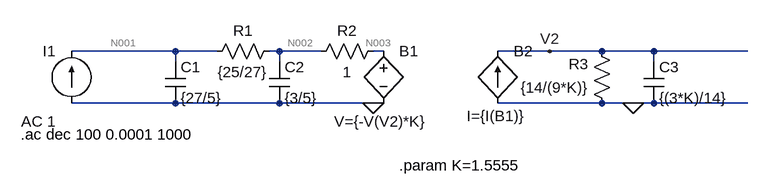
[diagram p0: schematic Draft2.asc]
Draft2.asc, the LTspice schematic file:
Version 4
SHEET 1 932 680
WIRE 48 112 -112 112
WIRE 112 112 48 112
WIRE 208 112 192 112
WIRE 272 112 208 112
WIRE 368 112 352 112
WIRE 624 112 544 112
WIRE 704 112 624 112
WIRE 784 112 704 112
WIRE 928 112 784 112
WIRE 48 128 48 112
WIRE 208 128 208 112
WIRE 784 128 784 112
WIRE 48 192 -112 192
WIRE 208 192 48 192
WIRE 352 192 208 192
WIRE 368 192 352 192
WIRE 704 192 544 192
WIRE 752 192 704 192
WIRE 784 192 752 192
WIRE 928 192 784 192
FLAG 624 112 V2
FLAG 352 192 0
FLAG 752 192 0
SYMBOL cap 32 128 R0
SYMATTR InstName C1
SYMATTR Value {27/5}
SYMBOL res 208 96 R90
WINDOW 0 0 56 VBottom 2
WINDOW 3 32 56 VTop 2
SYMATTR InstName R1
SYMATTR Value {25/27}
SYMBOL cap 192 128 R0
SYMATTR InstName C2
SYMATTR Value {3/5}
SYMBOL res 368 96 R90
WINDOW 0 0 56 VBottom 2
WINDOW 3 32 56 VTop 2
SYMATTR InstName R2
SYMATTR Value 1
SYMBOL res 720 208 R180
WINDOW 0 36 76 Left 2
WINDOW 3 36 40 Left 2
SYMATTR InstName R3
SYMATTR Value {14/(9*K)}
SYMBOL cap 768 128 R0
SYMATTR InstName C3
SYMATTR Value {(3*K)/14}
SYMBOL current -112 192 R180
WINDOW 0 24 80 Left 2
WINDOW 3 24 0 Left 2
WINDOW 123 24 -28 Left 2
WINDOW 39 0 0 Left 0
SYMATTR InstName I1
SYMATTR Value ""
SYMATTR Value2 AC 1
SYMBOL bv 368 96 R0
WINDOW 3 -76 124 Left 2
SYMATTR InstName B1
SYMATTR Value V={-V(V2)*K}
SYMBOL bi2 544 112 R0
WINDOW 3 -48 100 Left 2
SYMATTR InstName B2
SYMATTR Value I={I(B1)}
TEXT -190 240 Left 2 !.ac dec 100 0.0001 1000
TEXT 392 288 Left 2 !.param K=1.5555

The netlist it stands for:
* Draft2.asc
C1 N001 0 {27/5}
R1 N002 N001 {25/27}
C2 N002 0 {3/5}
R2 N003 N002 1
R3 0 V2 {14/(9*K)}
C3 V2 0 {(3*K)/14}
I1 0 N001 AC 1
B1 N003 0 V={-V(V2)*K}
B2 0 V2 I={I(B1)}
.ac dec 100 0.0001 1000
.param K=1.5555
.backanno
.end

* Results of the author's LTspice run, read from the files saved beside the schematic
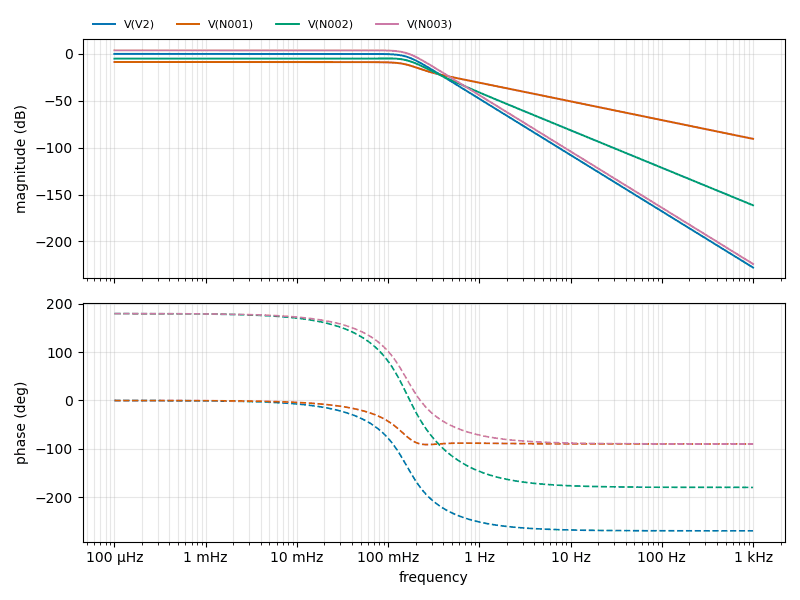
[diagram p1: AC Analysis of Draft2.asc, plotted from the saved traces]
* AC Analysis, 1 run:
*   V(V2): 0.00 dB at 100 µHz, -227.89 dB at 1 kHz, peak 0.00 dB at 195 µHz, 3 dB below the peak at 159.1 mHz
*   V(N001): -8.63 dB at 100 µHz, -90.61 dB at 1 kHz, peak -8.63 dB at 100 µHz, 3 dB below the peak at 162.9 mHz
*   V(N002): -5.11 dB at 100 µHz, -161.47 dB at 1 kHz, peak -4.77 dB at 91.2 mHz, 3 dB below the peak at 172.8 mHz
*   V(N003): 3.84 dB at 100 µHz, -224.05 dB at 1 kHz, peak 3.84 dB at 223.9 µHz, 3 dB below the peak at 159.1 mHz